# Altium schematic sheet temperature.SchDoc: Temperature Sensor
size A4; CheckedBy: rrodrigu; Author: Satxo; CompanyName: Satxo; Revision: 0v1; SheetNumber: 6; SheetTotal: 8; ProjectName: Basestation
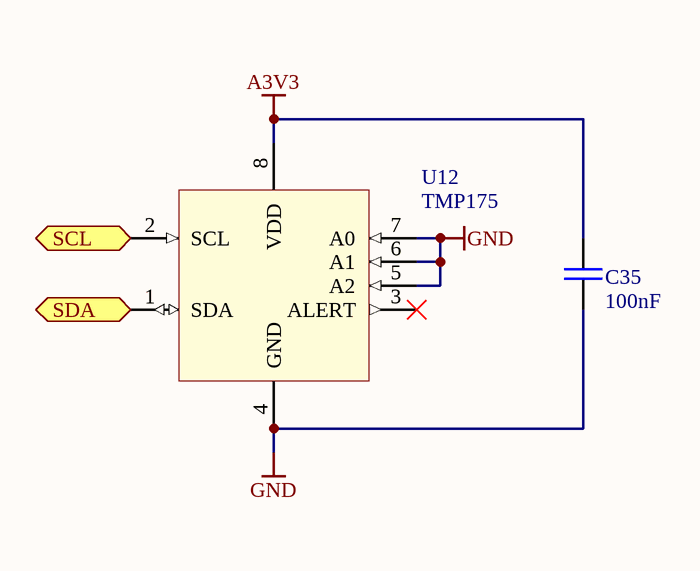
[diagram p0: temperature.SchDoc]

## Parts
C35  100nF  [0603]
U12  TMP175  [SOIC-8]

## Ports
SCL (in), SDA (bidir)

## Nets
A3V3: C35.2 U12.8(VDD)
GND: C35.1 U12.4(GND) U12.5(A2) U12.6(A1) U12.7(A0)
SCL: U12.2(SCL) ; port SCL
SDA: U12.1(SDA) ; port SDA

Not connected (* = marked no-connect by the designer): U12 3(ALERT)*

## Notes on the sheet
- Title
- Size:
- Date:
- A4
- Number:
- Time:
- Revision:
- Sheet
- of
- File:

## Library data of the parts
C35 = CAP: Capacitor; Owner: Nuno Brum; Sub-Type: Ceramic; Assembly: INS; Maximum Voltage: *; Creation Date: 2005-04-28; Status: Valid; Validation date: 2006-05-15; Type: Capacitor
U12 = TMP175: Digital Temperature Sensor; Type: IC; Creation Date: 2012-03-05